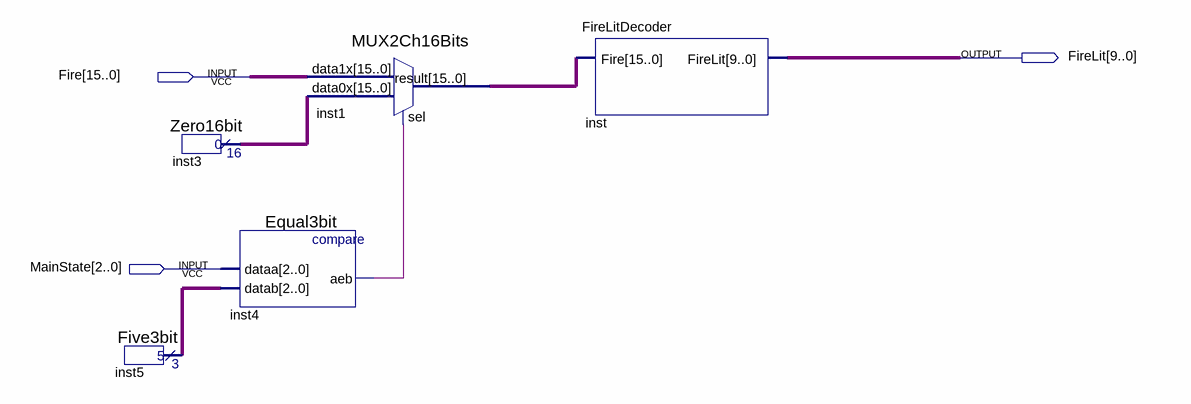
[diagram p0: schematic sheet]
// Quartus schematic FireLit.bdf as structural Verilog: 5 symbols, 3 pins
module FireLit (
  input  [15:0] Fire,
  input  [2:0] MainState,
  output [9:0] FireLit
);

  wire inst4_aeb;
  wire [2:0] inst5_result;
  wire [15:0] inst1_result, inst3_result;

  Five3bit inst5 (.result(inst5_result));
  Zero16bit inst3 (.result(inst3_result));
  Equal3bit inst4 (.dataa(MainState), .datab(inst5_result), .aeb(inst4_aeb));
  MUX2Ch16Bits inst1 (.data1x(Fire), .data0x(inst3_result), .sel(inst4_aeb), .result(inst1_result));
  FireLitDecoder inst (.Fire(inst1_result), .FireLit(FireLit));
endmodule
